# Altium schematic sheet circuit.schdoc
size A; SheetNumber: 1; SheetTotal: 1
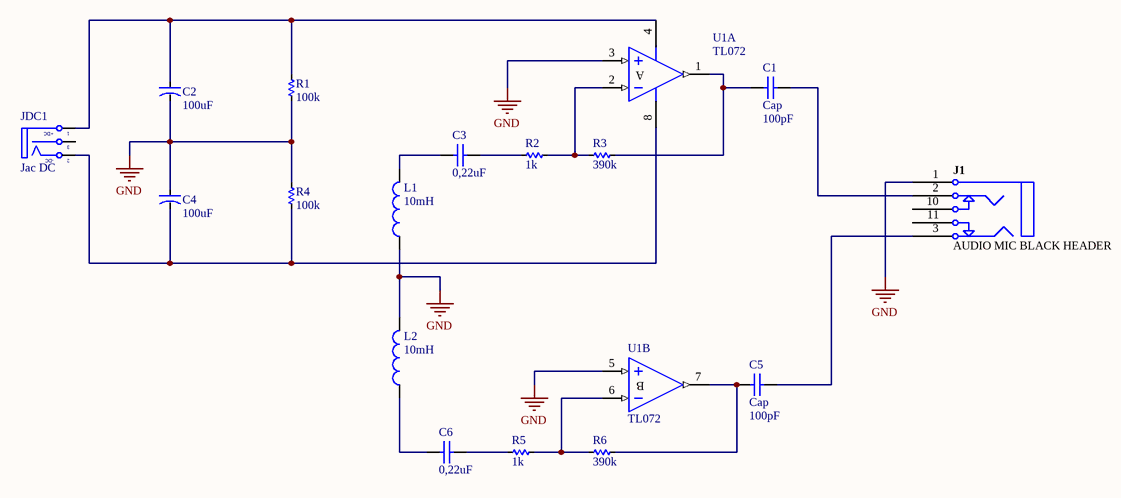
[diagram p0: circuit.schdoc]

## Parts
C1  Cap  value 100pF  [RAD-0.3]
C2  100uF  [CA-ALU-2.54]
C3  0,22uF  [RAD-0.3]
C4  100uF  [CA-ALU-2.54]
C5  Cap  value 100pF  [RAD-0.3]
C6  0,22uF  [RAD-0.3]
J1  AUDIO MIC BLACK HEADER  [CON MIC1]
JDC1  Jac DC  [DC0]
L1  10mH  [0402-A]
L2  10mH  [0402-A]
R1  100k  [RES-1/4WD]
R2  1k  [RES-1/4WD]
R3  390k  [RES-1/4WD]
R4  100k  [RES-1/4WD]
R5  1k  [RES-1/4WD]
R6  390k  [RES-1/4WD]
U1  TL072  [DIP8]  (parts A,B of 2)

## Nets
GND: C2.2 C4.1 J1.1 L1.1 L2.2 R1.2 R4.2 U1.3(IN+) U1.5(IN+)
NetC1_1: C1.1 R3.1 U1.1(OUT)
NetC1_2: C1.2 J1.2
NetC2_1: C2.1 JDC1.1(T) R1.1 U1.4(V-)
NetC3_1: C3.1 L1.2
NetC3_2: C3.2 R2.2
NetC4_2: C4.2 JDC1.2(TN) R4.1 U1.8(V+)
NetC5_1: C5.1 R6.1 U1.7(OUT)
NetC5_2: C5.2 J1.3
NetC6_1: C6.1 L2.1
NetC6_2: C6.2 R5.2
NetR2_1: R2.1 R3.2 U1.2(IN-)
NetR5_1: R5.1 R6.2 U1.6(IN-)

Not connected (* = marked no-connect by the designer): J1 10 11; JDC1 3(S)

## Notes on the sheet
- (in symbol DCIN) +DC; -DC
- (in symbol TL072, part A) A
- (in symbol TL072, part B) B

## Library data of the parts
C1 C3 C5 C6 = Cap: Capacitor; Published: 8-Jun-2000; LatestRevisionDate: 17-Jul-2002; LatestRevisionNote: Re-released for DXP Platform.; PackageReference: RAD-0.3; Publisher: Altium Limited; PackageDescription: Radial Cap, Thru-Hole; 2 Leads; 0.3 in Pin Spacing
C2 C4 = CN-ALU-DIP: Capacitor (Semiconductor SIM Model); Value: 104; LatestRevisionDate: 17-Jul-2002; LatestRevisionNote: Re-released for DXP Platform.; PackageReference: C1206; Publisher: Altium Limited
J1 = CON MIC1: Connector, 3.5mm Stereo Audio Socket, Black, 2 break contacts (normals) and 2 auxiliary make contacts; Connector type: AUDIO BLACK HEADER; Category: Connector; Status: Production
JDC1 = DCIN: Jac DC input; Value: Jac DC
L1 L2 = Inductor: Code_IEC: 1005; Published: 8-Jun-2000; LatestRevisionDate: 29-May-2009; LatestRevisionNote: IPC-7351 Footprint Added.; PackageReference: 0402-A; Publisher: Altium Limited; PackageDescription: Chip Inductor; Code_JEITA: 0402
R1-R6 = Res: Manufacturer: Generic Components; Class: Passive; SubClass: R; Published: 08/06/2000; Publisher: Altium Hobart Technology Centre